# EAGLE design scard (EAGLE 8.4.0)
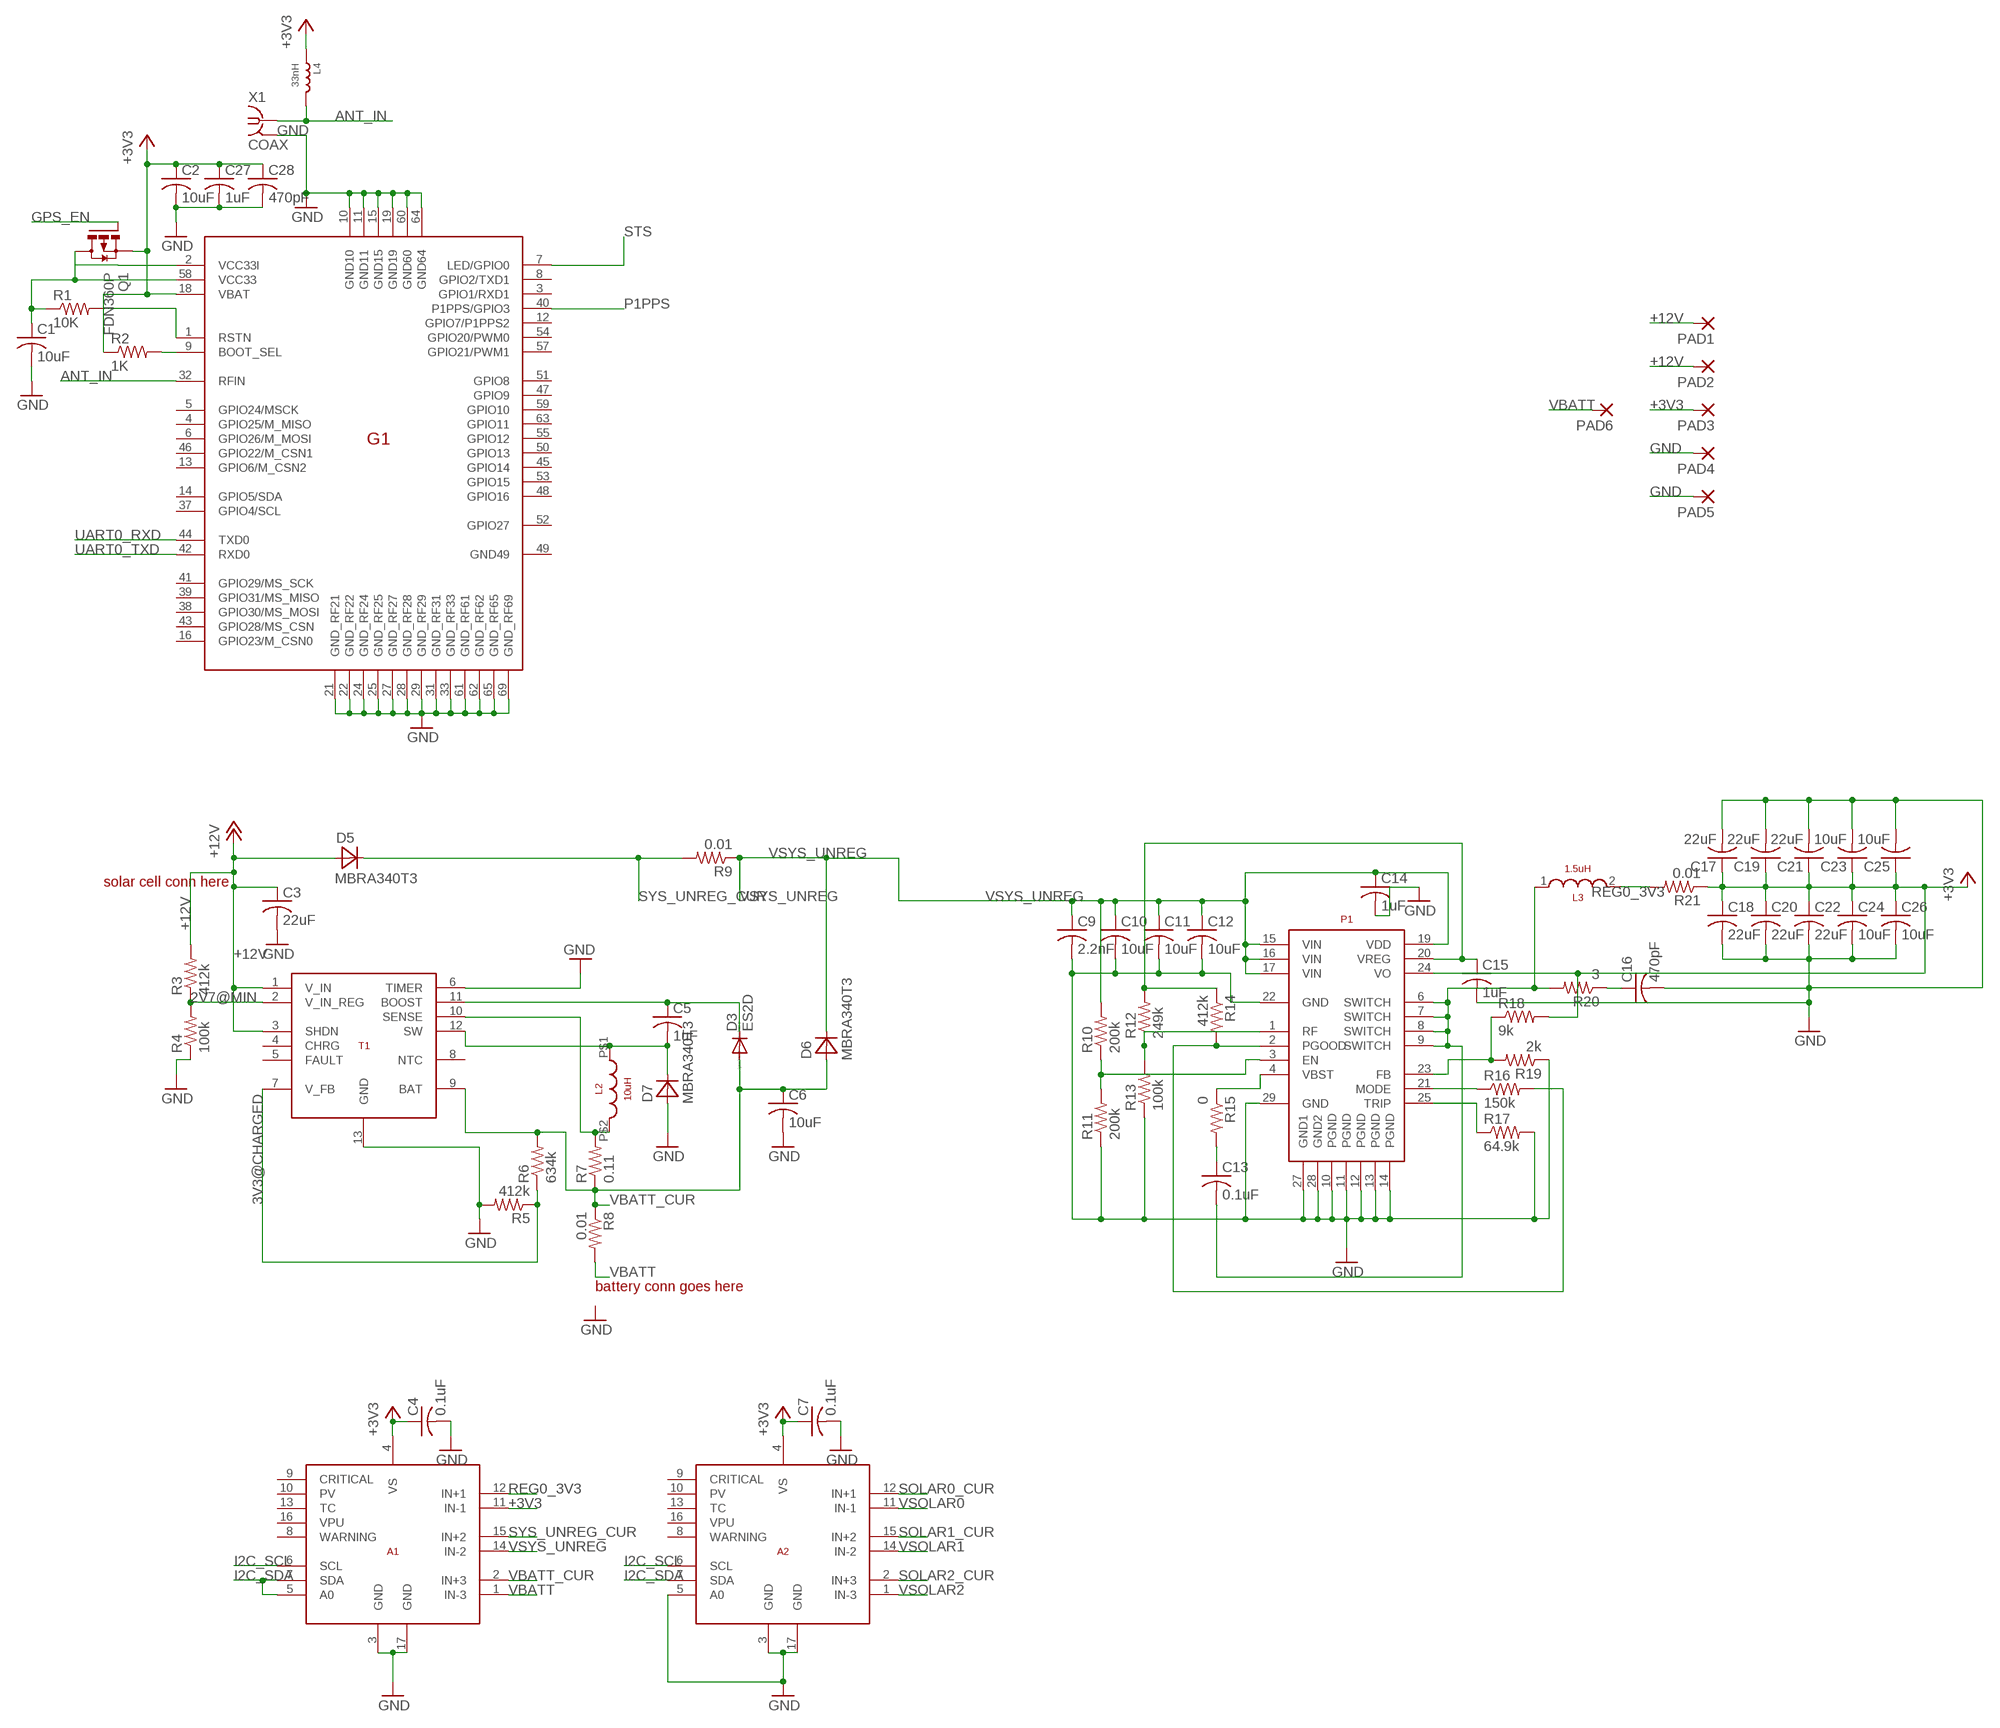
[diagram p0: schematic, sheet 1]

## Parts
A1  INA3221-Q1  [VQFN16]
A2  INA3221-Q1  [VQFN16]
C1  10uF  C-USC0603  [C0603]
C2  10uF  C-USC0603  [C0603]
C3  22uF  C-USC0805  [C0805]
C4  0.1uF  C-USC0603  [C0603]
C5  1uF  C-USC0402  [C0402]
C6  10uF  C-USC0805  [C0805]
C7  0.1uF  C-USC0603  [C0603]
C9  2.2nF  C-USC0402  [C0402]
C10  10uF  C-USC0603  [C0603]
C11  10uF  C-USC0603  [C0603]
C12  10uF  C-USC0603  [C0603]
C13  0.1uF  C-USC0402  [C0402]
C14  1uF  C-USC0402  [C0402]
C15  1uF  C-USC0402  [C0402]
C16  470pF  C-USC0402  [C0402]
C17  22uF  C-USC0805  [C0805]
C18  22uF  C-USC0805  [C0805]
C19  22uF  C-USC0805  [C0805]
C20  22uF  C-USC0805  [C0805]
C21  22uF  C-USC0805  [C0805]
C22  22uF  C-USC0805  [C0805]
C23  10uF  C-USC0603  [C0603]
C24  10uF  C-USC0603  [C0603]
C25  10uF  C-USC0603  [C0603]
C26  10uF  C-USC0603  [C0603]
C27  1uF  C-USC0402  [C0402]
C28  470pF  C-USC0402  [C0402]
D3  ES2D  [SMB]
D5  MBRA340T3  [SMA]
D6  MBRA340T3  [SMA]
D7  MBRA340T3  [SMA]
G1  VENUS838FLPX-L  [LGA69]
L2  10uH  SRP7030-100M  [SRP7030]
L3  1.5uH  SRP7028A  [SRP7028A]
L4  33nH  SMD-FERRITE-BEAD-330R-1500MA(0805)'0805'  [L0805]
P1  TPS548A20  [R-PWQFN-N28]
PAD1  SMD5  [SMD2,54-5,08]
PAD2  SMD5  [SMD2,54-5,08]
PAD3  SMD5  [SMD2,54-5,08]
PAD4  SMD5  [SMD2,54-5,08]
PAD5  SMD5  [SMD2,54-5,08]
PAD6  SMD5  [SMD2,54-5,08]
Q1  FDN360P  [SUPER-SOT3]
R1  10K  R-US_R0603  [R0603]
R2  1K  R-US_R0603  [R0603]
R3  412k  R-US_R0603  [R0603]
R4  100k  R-US_R0603  [R0603]
R5  412k  R-US_R0603  [R0603]
R6  634k  R-US_R0603  [R0603]
R7  0.11  R-US_R0603  [R0603]
R8  0.01  R-US_R0603  [R0603]
R9  0.01  R-US_R0603  [R0603]
R10  200k  R-US_R0603  [R0603]
R11  200k  R-US_R0603  [R0603]
R12  249k  R-US_R0603  [R0603]
R13  100k  R-US_R0603  [R0603]
R14  412k  R-US_R0603  [R0603]
R15  0  R-US_R0603  [R0603]
R16  150k  R-US_R0603  [R0603]
R17  64.9k  R-US_R0603  [R0603]
R18  9k  R-US_R0603  [R0603]
R19  2k  R-US_R0603  [R0603]
R20  3  R-US_R0603  [R0603]
R21  0.01  R-US_R0603  [R0603]
T1  LT3652  [MSOP12]
X1  COAX  [MMCX-J-P-X-ST-EM1-MKT]

## Nets
2V7@MIN: R3.1 R4.2 T1.2(V_IN_REG)
3V3@CHARGED: R5.1 R6.1 T1.7(V_FB)
+3V3: A1.4(VS) A1.11(IN-1) A2.4(VS) C2.1 C4.1 C7.1 C17.1 C18.1 C19.1 C20.1 C21.1 C22.1 C23.1 C24.1 C25.1 C26.1 C27.1 C28.1 G1.18(VBAT) L4.1 P1.24(VO) PAD3.1(P) Q1.2(S) R2.1 R18.2 R21.1
+12V: C3.1 D5.A PAD1.1(P) PAD2.1(P) R3.2 T1.1(V_IN) T1.3(SHDN)
ANT_IN: G1.32(RFIN) L4.2 X1.1
GND: A1.3(GND) A1.17(GND) A2.3(GND) A2.5(A0) A2.17(GND) C1.2 C2.2 C3.2 C4.2 C6.2 C7.2 C9.2 C10.2 C11.2 C12.2 C14.2 C15.2 C16.2 C17.2 C18.2 C19.2 C20.2 C21.2 C22.2 C23.2 C24.2 C25.2 C26.2 C27.2 C28.2 D7.A G1.10(GND10) G1.11(GND11) G1.15(GND15) G1.19(GND19) G1.21(GND_RF21) G1.22(GND_RF22) G1.24(GND_RF24) G1.25(GND_RF25) G1.27(GND_RF27) G1.28(GND_RF28) G1.29(GND_RF29) G1.31(GND_RF31) G1.33(GND_RF33) G1.60(GND60) G1.61(GND_RF61) G1.62(GND_RF62) G1.64(GND64) G1.65(GND_RF65) G1.69(GND_RF69) P1.10(PGND) P1.11(PGND) P1.12(PGND) P1.13(PGND) P1.14(PGND) P1.22(GND) P1.27(GND1) P1.28(GND2) P1.29(GND) PAD4.1(P) PAD5.1(P) R4.1 R5.2 R11.1 R13.1 R17.2 R19.1 T1.6(TIMER) T1.13(GND) X1.2@1(GND)
GPS_EN: Q1.1(G)
I2C_SCL: A1.6(SCL) A2.6(SCL)
I2C_SDA: A1.5(A0) A1.7(SDA) A2.7(SDA)
N$1: P1.21(MODE) R16.1
N$2: C13.2 L3.1 P1.6(SWITCH) P1.7(SWITCH) P1.8(SWITCH) P1.9(SWITCH) R20.2
N$3: C5.1 D3.C T1.11(BOOST)
N$5: P1.4(VBST) R15.1
N$6: L2.P$2 R7.2 T1.10(SENSE)
N$7: G1.9(BOOT_SEL) R2.2
N$8: G1.1(RSTN) R1.2
N$9: C13.1 R15.2
N$10: C15.1 P1.20(VREG) R12.2 R14.1
N$11: P1.1(RF) R12.1 R13.2
N$12: P1.2(PGOOD) R14.2 R16.2
N$13: P1.25(TRIP) R17.1
N$14: P1.23(FB) R18.1 R19.2
N$15: P1.3(EN) R10.1 R11.2
N$16: C1.1 G1.2(VCC33I) G1.58(VCC33) Q1.3(D) R1.1
N$17: C16.1 R20.1
N$18: C5.2 D7.C L2.P$1 T1.12(SW)
P1PPS: G1.40(P1PPS/GPIO3)
REG0_3V3: A1.12(IN+1) L3.2 R21.2
SOLAR0_CUR: A2.12(IN+1)
SOLAR1_CUR: A2.15(IN+2)
SOLAR2_CUR: A2.2(IN+3)
STS: G1.7(LED/GPIO0)
SYS_UNREG_CUR: A1.15(IN+2) D5.C R9.2
UART0_RXD: G1.44(TXD0)
UART0_TXD: G1.42(RXD0)
VBATT: A1.1(IN-3) PAD6.1(P) R8.2
VBATT_CUR: A1.2(IN+3) C6.1 D3.A D6.A R6.2 R7.1 R8.1 T1.9(BAT)
VSOLAR0: A2.11(IN-1)
VSOLAR1: A2.14(IN-2)
VSOLAR2: A2.1(IN-3)
VSYS_UNREG: A1.14(IN-2) C9.1 C10.1 C11.1 C12.1 C14.1 D6.C P1.15(VIN) P1.16(VIN) P1.17(VIN) P1.19(VDD) R9.1 R10.2
Unconnected: A1.8(WARNING) A1.9(CRITICAL) A1.10(PV) A1.13(TC) A1.16(VPU) A2.8(WARNING) A2.9(CRITICAL) A2.10(PV) A2.13(TC) A2.16(VPU) G1.3(GPIO1/RXD1) G1.4(GPIO25/M_MISO) G1.5(GPIO24/MSCK) G1.6(GPIO26/M_MOSI) G1.8(GPIO2/TXD1) G1.12(GPIO7/P1PPS2) G1.13(GPIO6/M_CSN2) G1.14(GPIO5/SDA) G1.16(GPIO23/M_CSN0) G1.37(GPIO4/SCL) G1.38(GPIO30/MS_MOSI) G1.39(GPIO31/MS_MISO) G1.41(GPIO29/MS_SCK) G1.43(GPIO28/MS_CSN) G1.45(GPIO14) G1.46(GPIO22/M_CSN1) G1.47(GPIO9) G1.48(GPIO16) G1.49(GND49) G1.50(GPIO13) G1.51(GPIO8) G1.52(GPIO27) G1.53(GPIO15) G1.54(GPIO20/PWM0) G1.55(GPIO12) G1.57(GPIO21/PWM1) G1.59(GPIO10) G1.63(GPIO11) T1.4(CHRG) T1.5(FAULT) T1.8(NTC)

## Notes on the sheet
- solar cell conn here
- battery conn goes here

## Power pins joined to a net without a drawn wire
GND: X1.2@2(GND) X1.2@3(GND) X1.2@4(GND)

## Library data of the parts
A1 A2 = calsat:INA3221-Q1: INA3221-Q1 current sense amplifier with I2C interface
C1 C5 C17-C22 = rcl:C-US: CAPACITOR, American symbol
C2-C4 C6 C7 C9-C16 C23-C28 = resistor:C-US: CAPACITOR, American symbol
D3 = diode:ES2D: DIODE super fast rectifier, 2 A
D5-D7 = diode:MBRA340T3: Surface Mount Schottky Power Rectifier Source: http://www.onsemi.com/pub_link/Collateral/MBRA340T3-D.PDF
G1 = calsat:VENUS838FLPX-L: aerospace GPS chipset
L2 = calsat:SRP7030-100M: SRP7030-100M 3A 10uH power inductor source: http://www.mouser.com/ds/2/54/SRP7030-33303.pdf
L3 = calsat:SRP7028A: Shielded power inductor
L4 = Seeed-Inductor:SMD-FERRITE-BEAD-330R-1500MA(0805): 303030006; MPN: BLM21PG331SN1D; VALUE: 330R-1500MA
P1 = calsat:TPS548A20: TPS548A20 switching voltage regulator
PAD1-PAD6 = wirepad:SMD5: SMD PAD
Q1 = transistor-power:FDN360P: Single P-Channel, PowerTrench (R) MOSFET Source: http://www.fairchildsemi.com/ds/FD/FDN360P.pdf
R1 R3-R21 = rcl:R-US_: RESISTOR, American symbol
R2 = resistor:R-US_: RESISTOR, American symbol
T1 = calsat:LT3652: LT3652 LiPo Li-ion battery charging IC
X1 = con-samtec:COAX: MMCX STRAIGHT, EDGE MOUNT JACK- 50 OHM Source: http://www.samtec.com/ftppub/cpdf/MMCX-J-P-X-ST-EM1-MKT.pdf; OC_FARNELL: unknown; OC_NEWARK: unknown

## Board
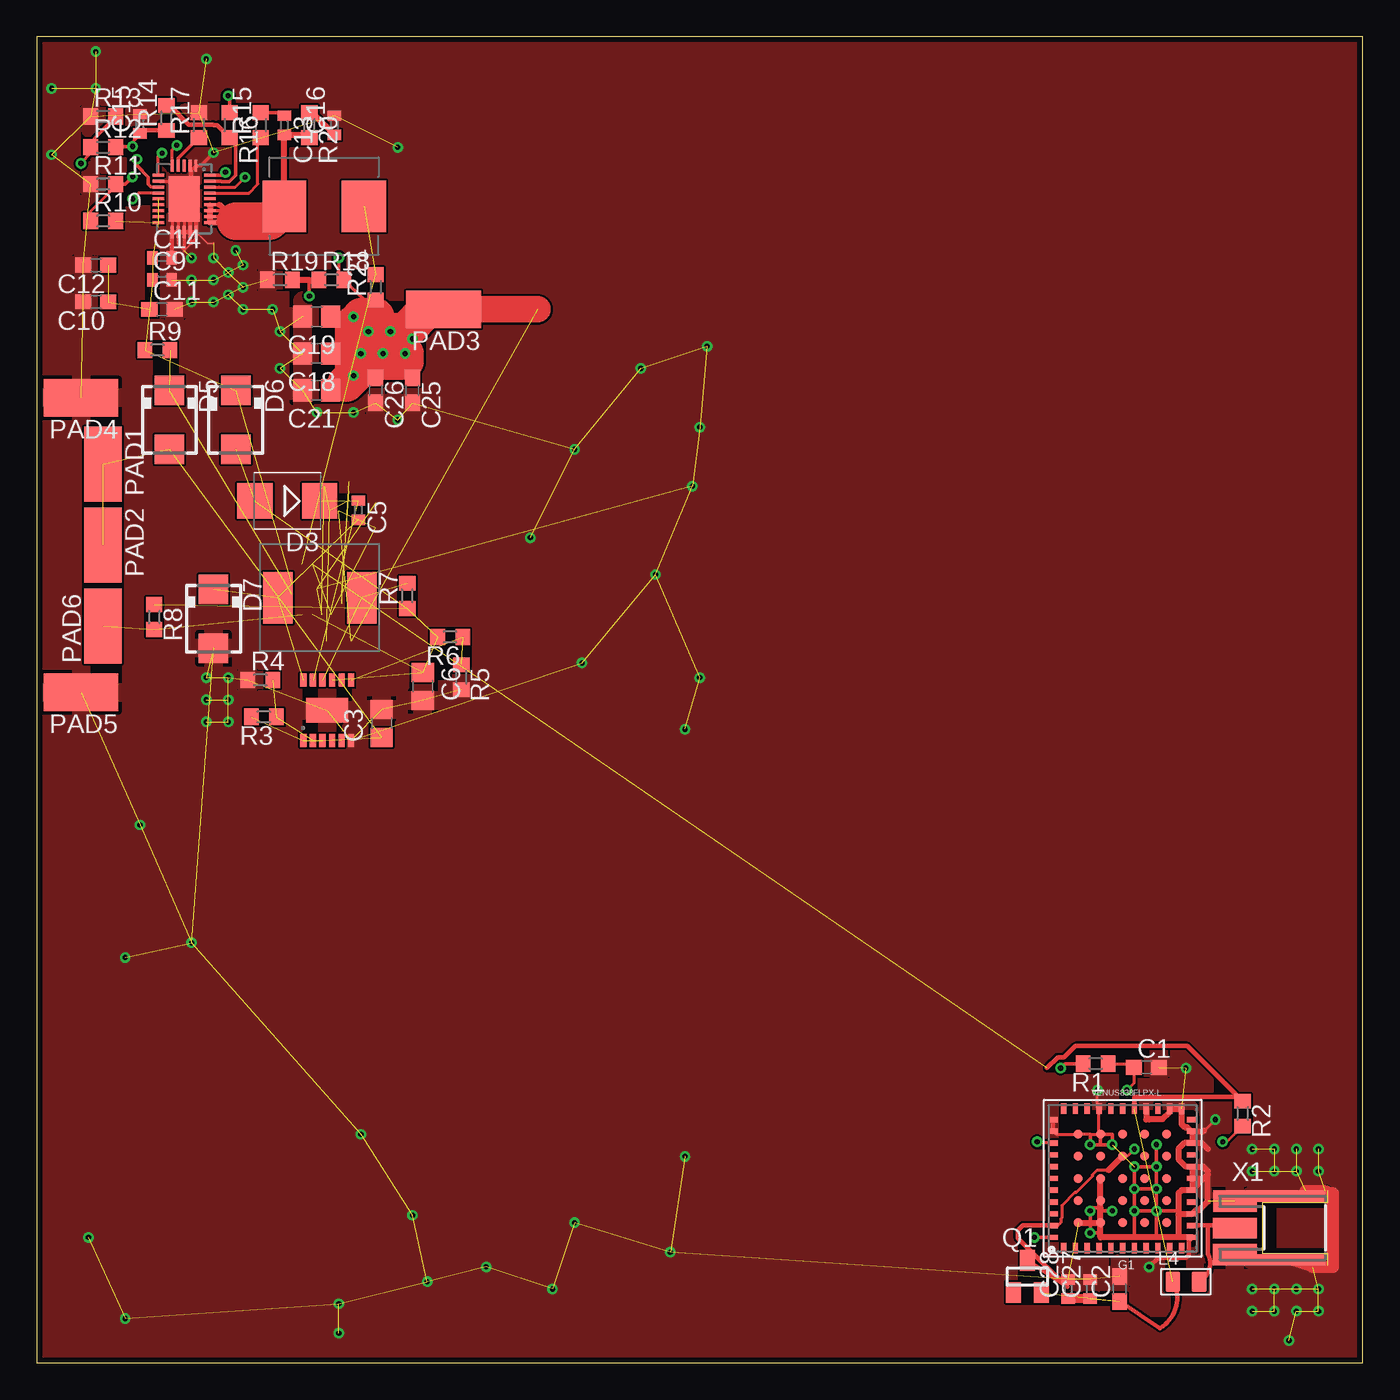
[diagram p1: board, top side]
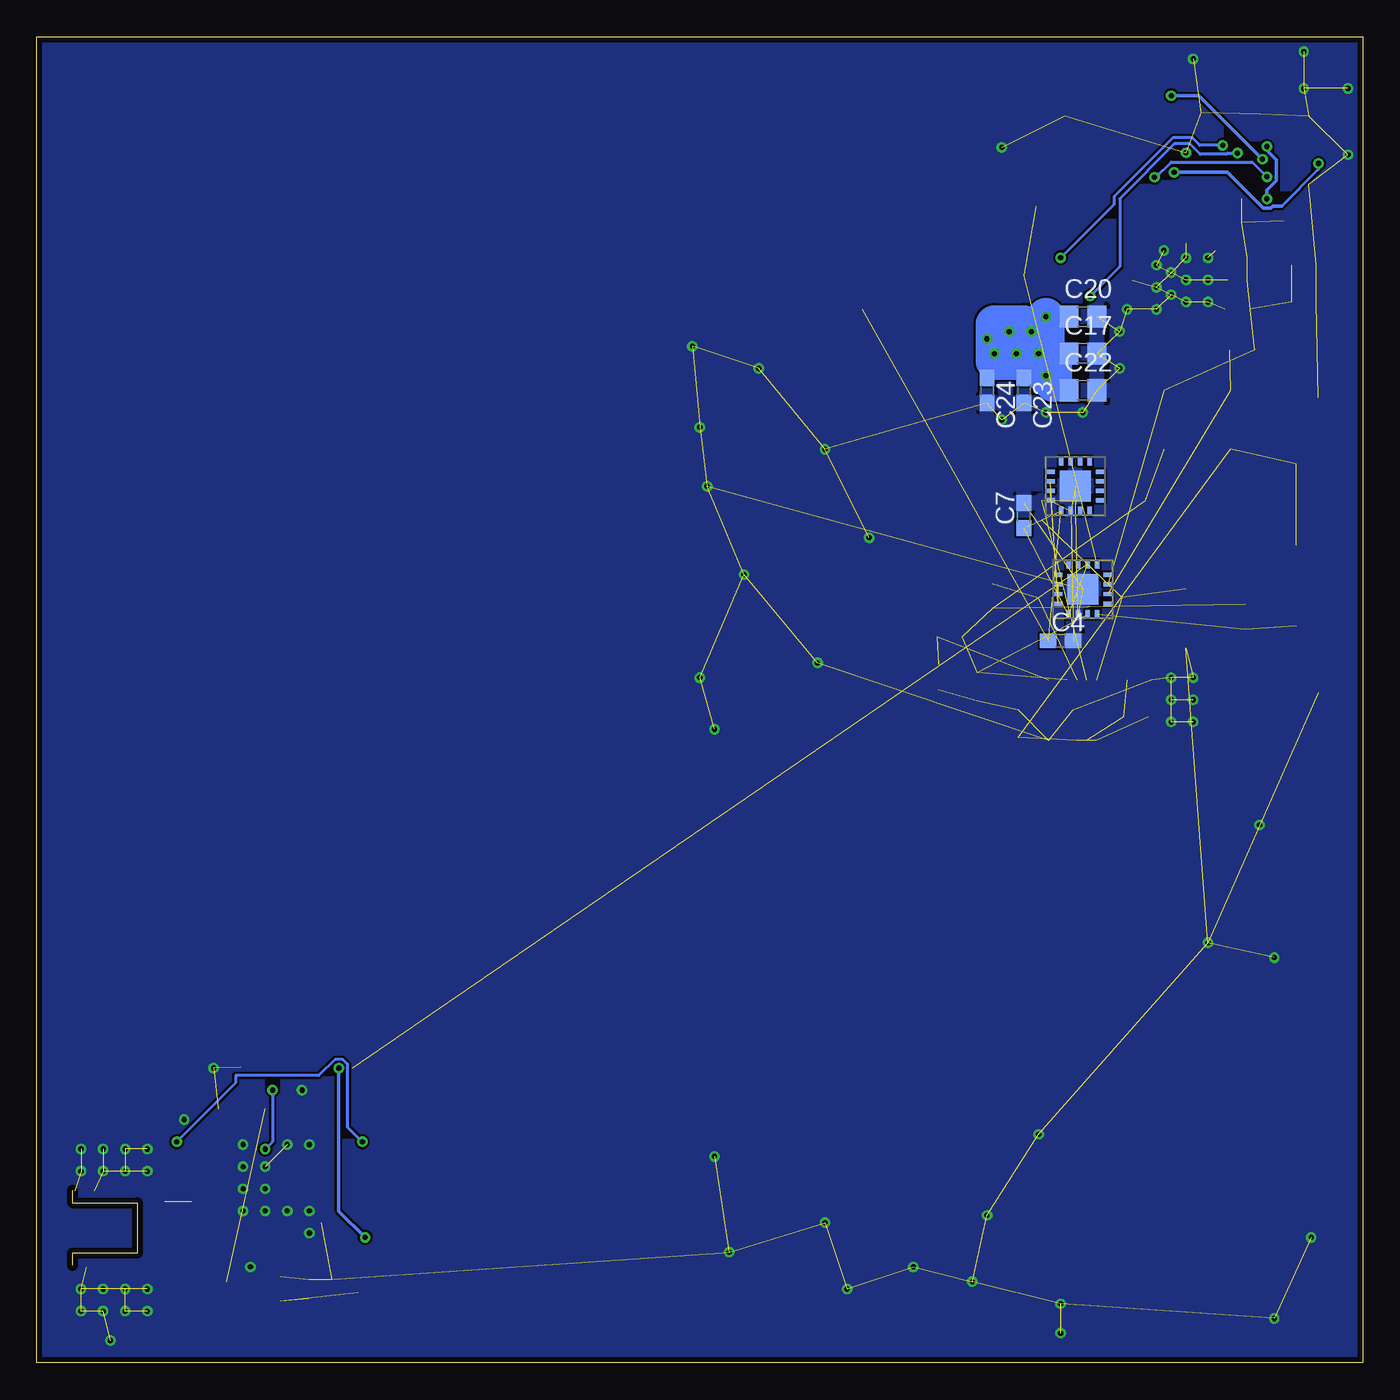
[diagram p2: board, bottom side, seen from below]

Size 90 x 90 mm. Coordinates in mm from the lower left corner, seen from the top.
Outline: 0,0 90,0 90,90 0,90 0,0
Copper layers (1*16): Top 0.0356mm / dielectric 1.5011mm / Bottom 0.0356mm
Design rules "oshpark-2layer": minimum track width 6mil, minimum drill 13mil, track to track 6mil, track to pad 6mil, pad to pad 6mil, via to via 6mil, smd to smd 6mil, copper to edge 15mil, drill to drill 6mil, minimum pad ring 7mil, minimum via ring 7mil, stop-mask expansion 2.5mil, vias tented up to drill 0mil, thermal gap 10mil

### Footprints (pad centres in the part's own frame; a part is rotated, then mirrored left to right if it is on the bottom)
VQFN16 = smd 0.3 x 0.6: 1 -0.975,1.7; 2 -0.325,1.7; 3 0.325,1.7; 4 0.975,1.7; 9 0.975,-1.7; 10 0.325,-1.7; 11 -0.325,-1.7; 12 -0.975,-1.7 | smd 0.6 x 0.3: 5 1.7,0.975; 6 1.7,0.325; 7 1.7,-0.325; 8 1.7,-0.975; 13 -1.7,-0.975; 14 -1.7,-0.325; 15 -1.7,0.325; 16 -1.7,0.975 | smd 2.1 x 2.1: 17 0,0
C0603 = smd 1.1 x 1: 1 -0.85,0; 2 0.85,0
C0805 = smd 1.3 x 1.5: 1 -0.95,0; 2 0.95,0
C0402 = smd 0.7 x 0.9: 1 -0.65,0; 2 0.65,0
SMB = smd 2.4 x 2.4: A 2.2,0; C -2.2,0
SMA = smd 2 x 2: A 2,0; C -2,0
LGA69 = smd 0.7 x 0.36: 1 4.73,4; 2 4.73,3.2; 3 4.73,2.4; 4 4.73,1.6; 5 4.73,0.8; 6 4.73,0; 7 4.73,-0.8; 8 4.73,-1.6; 9 4.73,-2.4; 10 4.73,-3.2; 11 4.73,-4; 23 -4.73,-4; 24 -4.73,-3.2; 25 -4.73,-2.4; 26 -4.73,-1.6; 27 -4.73,-0.8; 28 -4.73,0; 29 -4.73,0.8; 30 -4.73,1.6; 31 -4.73,2.4; 32 -4.73,3.2; 33 -4.73,4 | smd 0.36 x 0.7: 12 4,-4.73; 13 3.2,-4.73; 14 2.4,-4.73; 15 1.6,-4.73; 16 0.8,-4.73; 17 0,-4.73; 18 -0.8,-4.73; 19 -1.6,-4.73; 20 -2.4,-4.73; 21 -3.2,-4.73; 22 -4,-4.73; 34 -4,4.73; 35 -3.2,4.73; 36 -2.4,4.73; 37 -1.6,4.73; 38 -0.8,4.73; 39 0,4.73; 40 0.8,4.73; 41 1.6,4.73; 42 2.4,4.73; 43 3.2,4.73; 44 4,4.73 | smd 0.6 x 0.6: 45 -3,3; 46 -3,1.5; 47 -3,0; 48 -3,-1.5; 49 -3,-3; 50 -1.5,3; 51 -1.5,1.5; 52 -1.5,0; 53 -1.5,-1.5; 54 -1.5,-3; 55 0,3; 56 0,1.5; 57 0,0; 58 0,-1.5; 59 0,-3; 60 1.5,3; 61 1.5,1.5; 62 1.5,0; 63 1.5,-1.5; 64 1.5,-3; 65 3,3; 66 3,1.5; 67 3,0; 68 3,-1.5; 69 3,-3
SRP7030 = smd 2 x 3.5: P$1 -2.85,0; P$2 2.85,0
SRP7028A = smd 2.95 x 3.5: 1 -2.7,0 | smd 3 x 3.5: 2 2.7,0
L0805 = smd 1.016 x 1.397: 1 -0.889,0; 2 0.889,0
R-PWQFN-N28 = smd 0.2 x 0.8: 1 -1.6,1.75; 2 -1.2,1.75; 3 -0.8,1.75; 4 -0.4,1.75; 5 0,1.75; 6 0.4,1.75; 7 0.8,1.75; 8 1.2,1.75; 9 1.6,1.75; 15 1.6,-1.75; 16 1.2,-1.75; 17 0.8,-1.75; 18 0.4,-1.75; 19 0,-1.75; 20 -0.4,-1.75; 21 -0.8,-1.75; 22 -1.2,-1.75; 23 -1.6,-1.75 | smd 0.8 x 0.2: 10 2.25,0.8; 11 2.25,0.4; 12 2.25,0; 13 2.25,-0.4; 14 2.25,-0.8; 24 -2.25,-0.8; 25 -2.25,-0.4; 26 -2.25,0; 27 -2.25,0.4; 28 -2.25,0.8 | smd 3.1 x 2.1: 29 0,0
SMD2,54-5,08 = smd 2.54 x 5.08: 1 0,0
SUPER-SOT3 = smd 1 x 1.4: 1 -0.95,-1.1; 2 0.95,-1.1; 3 0,1.1
R0603 = smd 1 x 1.1: 1 -0.85,0; 2 0.85,0
MSOP12 = smd 0.42 x 0.889: 1 -1.63,-2.04; 2 -0.98,-2.04; 3 -0.33,-2.04; 4 0.32,-2.04; 5 0.97,-2.04; 6 1.62,-2.04; 7 1.62,2.05; 8 0.97,2.05; 9 0.32,2.05; 10 -0.33,2.05; 11 -0.98,2.05; 12 -1.63,2.05 | smd 2.845 x 1.651: 13 0,0
MMCX-J-P-X-ST-EM1-MKT = smd 1.4 x 2.975: 1 0,-6.15 | smd 1.46 x 2.975: 2@1 -1.812,-6.125; 2@2 1.812,-6.138 | smd 0.76 x 4.7: 2@3 -2.163,-2.35; 2@4 2.163,-2.35

### Placement (x,y rotation side)
A1  19,52.5 180 bottom
A2  19.5,59.5 180 bottom
C1  75.32,20.05 0 top
C2  73.5,5 90 top
C3  23.41,43.39 90 top
C4  20.5,49 0 bottom
C5  21.82,57.87 270 top
C6  26.2,45.91 270 top
C7  23,57.5 90 bottom
C9  8.5,73.5 0 top
C10  4,72 180 top
C11  8.5,71.5 0 top
C12  4,74.5 180 top
C13  16.8,84 270 top
C14  8.5,75 0 top
C15  7,84.1 90 top
C16  20.2,84 90 top
C17  19,68.5 0 bottom
C18  19,68.5 180 top
C19  19,71 180 top
C20  19,71 0 bottom
C21  19,66 180 top
C22  19,66 0 bottom
C23  23,66 270 bottom
C24  25.5,66 270 bottom
C25  25.5,66 270 top
C26  23,66 270 top
C27  71.5,5 90 top
C28  70,5 90 top
D3  17,58.5 180 top
D5  9,64 270 top
D6  13.5,64 270 top
D7  12,50.5 270 top
G1  73.7,12.51 180 top
L2  19.2,51.93 0 top
L3  19.5,78.5 0 top
L4  78,5.5 0 top
P1  10,79 270 top
PAD1  4.5,61 180 top
PAD2  4.5,55.5 180 top
PAD3  27.6,71.5 90 top
PAD4  3,65.5 90 top
PAD5  3,45.5 90 top
PAD6  4.5,50 0 top
Q1  67.24,5.85 0 top
R1  71.87,20.3 180 top
R2  81.85,16.91 270 top
R3  15.41,43.84 180 top
R4  15.17,46.35 0 top
R5  28.81,46.53 270 top
R6  28.06,49.26 180 top
R7  25.15,52.05 90 top
R8  7.97,50.62 270 top
R9  8.19,68.74 0 top
R10  4.5,77.5 0 top
R11  4.5,80 0 top
R12  4.5,82.5 0 top
R13  4.5,84.6 0 top
R14  8.8,84.5 90 top
R15  15.2,84 90 top
R16  13.1,84 270 top
R17  11,84 90 top
R18  20,73.5 0 top
R19  16.5,73.5 0 top
R20  18.5,84 270 top
R21  23,73 90 top
T1  19.72,44.28 0 top
X1  87.46,9.15 270 top

### Tracks (layer width: path | path; a pad name or v marks a point on that pad's centre or on a via)
2V7@MIN  (2 unrouted)
3V3@CHARGED  (2 unrouted)
+3V3  (via drill 0.35)  (9 unrouted)
  Top 0.203: P1.24 9.2,82.33 v9.5,82.63 | v20.5,75 20.5,73.85 R18.2 | v21.5,67 20.95,67 C22.1 | C17.1 21.5,68.5 21.5,68 | 23,68 C26.1 | 25,68 25,67.35 C25.1 | 22,71 C19.1 | PAD3.1 26.5,71.5
  Top 0.254: R18.2 22.2,72.15 R21.1 23,71
  Top 0.305: G1.18 74.5,18 74.56,18.05 81.56,18.05 | R2.1 81.56,18.05 | 81.56,18.05 78.11,21.5 70.5,21.5 69.73,20.73 69.3,20.73 68.57,20 | L4.1 arc-90 76.24,2.35 C2.1 | 26,71.5 26.5,71.5 | v22,68.5 21.5,68.5 | v23.5,68.5 23.5,68 23,68 | v25.5,69.5 25,70 | v24,70 23.5,70 | 22,71 22,70.5 21.5,70.5 v21.5,71 23,71
  Top 0.61: 34,71.5 34.5,71.5 | C27.1 C28.1
  Top 1.8: PAD3.1 34,71.5
  Top 2.54: 23,71 22,71 | 21.5,68.5 21.5,70.5 | 21,66.5 v21.5,67 21.5,68 23,68 25,68 v25,68.5 23.5,70 25,70 26.5,71.5
  Bottom 0.203: v9.5,82.63 11.07,82.63 11.58,83.14 12.89,83.14 16.88,79.16 16.88,78.62 v20.5,75 | 25,68 25.5,67.5 C25.1 | 23,68 C26.1 | v21.5,67 20.5,66 C22.1 | 21.5,68.5 C17.1
  Bottom 0.305: C19.1 v21.5,71 21.5,70
  Bottom 2.54: v21.5,71 21.5,68.5 v21.5,67 21,66.5 21,68 23,68 25,68 25,70.5 23,70.5 | v22.5,70 21.5,70
+12V  (6 unrouted)
ANT_IN
  Top 0.254: 81.5,9.31 81.5,9 82.31,9 X1.1
  Top 0.305: 79.5,9.31 G1.32 | 79.5,9.31 80.65,9.31 X1.1 | L4.2 arc90 79.5,7.39 79.5,9.31
GND  (via drill 0.35)  (116 unrouted)
  Top 0.152: G1.29 G1.28 G1.27 | P1.10 11.55,76 12,76 | P1.11 10.4,76.6 | 9.6,76 9.6,75.9 10,75.5 10.4,75.9 | 10.4,76 10.4,75.9 | 10.5,76 10.4,75.9
  Top 0.2: G1.69 71.5,15.51 G1.64 72.1,15.61 G1.15 72,17.34 v72,18.5 | G1.62 G1.61 72.2,10.5 | G1.25 78.43,15 78.43,15.62 G1.24 | 79.25,15.75 v80,16.5 | 77.5,8.5 77.5,8.51 77.5,10 77.5,10.5 | 72.2,8.5 72.5,8.5 72.5,8.51 74.5,8.51 | 75.3,16.5 75.5,16.5 | 76.9,17 G1.21 | 78,13.31 G1.27
  Top 0.203: G1.10 69.17,15.51 G1.69 | P1.22 9.3,80.2 | 10,77.5 P1.12 | P1.13 9.6,77.4 9.5,77.5 | P1.14 9.2,78.2 9.5,78.5
  Top 0.254: P1.27 10.4,80.1 10.5,80 10.5,80.95 P1.28 11.12,81.25 v12,82.13 | 9.5,80 9.3,80.2 | P1.12 10,75.5 | P1.13 9.6,76 | P1.11 10.4,76 | P1.10 10.8,76.3 10.5,76 | v73,10.3 72.4,10.3 arc-90 72.2,10.5 71.5,10.5 v71.5,10.3 71.5,9.51 v71.5,8.8 72.2,8.8 72.2,8.51 | v74.5,10.3 74.5,8.51 | v74.5,11.8 v74.5,10.3 | v74.5,11.8 v74.5,13.3 v76,13.3 | v76,14.8 v76,13.3 | v76,13.3 v76,11.8 | v76,11.8 v74.5,11.8 | v76,11.8 v76,10.3 | v76,10.3 v74.5,10.3 | v76,10.3 76,8.51 | v76,10.3 77.5,10.3 77.5,10.5 | 72.2,14.8 G1.64 72.99,15.51 73,15.5 v73,14.8 72.2,14.8 | 72.2,14.8 v71.5,14.8 71.5,15.51
  Top 0.305: G1.11 G1.10 | X1.2@1 82.77,11.4 86.11,11.4 | X1.2@2 82.76,6.9 86.11,6.9 | v75.5,6.5 76.12,7.12 78.01,7.12 78.19,7.3 78.19,8.27 G1.33 | P1.29 10,80 9.5,80 | P1.29 10,80.1 10.4,80.1 | P1.29 10,78.5 9.5,78.5 | C14.2 9.15,76.75 P1.14 P1.13 P1.12 P1.11 | P1.11 P1.10 10.8,78 10.4,78 P1.11
  Top 0.406: 86.11,11.65 86.11,11.4 X1.2@3 | X1.2@4 86.11,6.9 | G1.33 77.5,8.51 | 77.5,8.51 76,8.51 74.5,8.51 72.2,8.51 | 72.2,8.5 G1.60 | G1.60 72.2,10.5 G1.62 | G1.65 71.5,9.51 G1.60 | G1.19 75.3,16.5 | 75.5,16.5 75.53,16.53 76.43,16.53 76.89,17 76.9,17 | G1.21 G1.22 77.7,16.21 77.93,15.97 78.08,15.97 78.43,15.62 | 78.43,15 G1.24 79.21,15.71 79.25,15.75 | 79.5,14.5 79.09,14.91 G1.25 77.91,14.91 77.5,14.5 77.5,13.81 78,13.31 | G1.29 G1.27 79.19,13.31 79.5,13 79.5,12.78 | 79.23,12.51 G1.29 | G1.28 79.23,12.51 | 79.23,12.51 79.5,12.78 | G1.29 77.71,11.71 77.5,11.5 77.5,10.5 77.5,8.51 | 77.5,10 arc-90 77.61,10.11 G1.31 78.69,10.37 78.93,10.37 79.5,10.95 79.5,12.78
  Top 0.813: X1.2@4 86.6,6.5 88,6.5 88,11.5 87.99,11.49 87.76,11.49 87.42,11.65 86.11,11.65
  other vias: 1,86.5 33.5,56 16,71.5 42,53.5 85,1.5 45.5,69 20.5,2 30.5,6.5 3.5,8.5 10.5,28.5 20.5,4 22,15.5 44,43 37,47.5 13,46.5 1,82 4,89 24.5,82.5 21.5,64.5 41,67.5 44.5,59.5 16.5,67.5 45,63.5 16.5,70 6,3 6,27.5 7,36.5 78,20 19,64.5 24.5,64 85.5,5 84,5 82.5,5 85.5,3.5 84,3.5 82.5,3.5 85.5,13 84,13 82.5,13 82.5,14.5 84,14.5 85.5,14.5 87,14.5 87,13 87,5 87,3.5 11.5,46.5 13,43.5 11.5,43.5 36.5,9.5 25.5,10 26.5,5.5 35,5 36.5,62 4,86.5 11.5,88.5 12,75 13.5,75.5 10.5,75 12,73.5 10.5,73.5 13,74 14,73 14,74.5 10.5,72 14,71.5 12,72 13,72.5 45,46.5 11.5,45 13,45 44,14 43,7.5
  pour Top: -3,92.5 -3,-7 94,-7 94,92.5
  pour Bottom: -4.5,94 -5,-9.5 97,-9.5 97.5,94
I2C_SCL  (1 unrouted)
I2C_SDA  (2 unrouted)
N$1  (via drill 0.35)
  Top 0.203: 7.73,79.82 8.23,79.82 P1.21
  Top 0.254: R16.1 13.1,85.9 v13,86 | v6.8,81.7 6.8,81.25 7.57,80.48 7.57,79.98 7.73,79.82
  Bottom 0.254: v13,86 11.11,86 v6.8,81.7
N$2
  Top 0.254: 11.75,78.5 P1.6 12.4,78.6 | P1.7 12.8,78.2 13,78 12.8,77.8 P1.8
  Top 0.406: 11.75,78.54 11.75,78.5 P1.7 P1.8 P1.9 13.4,77.4 13.5,77.5 13,78 12.4,78.6 | L3.1 C13.2 18.5,83.35 R20.2
  Top 2.54: L3.1 15.8,77.5 13.5,77.5
N$3  (2 unrouted)
N$5
  Top 0.203: P1.4 14.4,79.4 15,80 15,82.95 R15.1
N$6  (2 unrouted)
N$7  (via drill 0.35)
  Top 0.2: G1.9 68,14.91 v67.91,15 | v80.5,15 80.79,15 R2.2
  Bottom 0.2: v67.91,15 68.89,15.99 68.89,20.25 69.25,20.61 69.75,20.61 70.86,19.5 76.5,19.5 76.5,19 v80.5,15
N$8  (via drill 0.35)
  Top 0.254: G1.1 v67.72,8.5 | v69.5,20 69.8,20.3 R1.2
  Bottom 0.254: v67.72,8.5 69.5,10.28 v69.5,20
N$9
  Top 0.254: R15.2 16.8,84.85 C13.1
N$10  (via drill 0.35)
  Top 0.203: P1.20 6.9,79.4
  Top 0.254: 6.9,79.4 v6.5,79 | R12.2 5.41,82.56 v6.5,82.56 6.5,82.85 C15.1 | R14.1 8.6,83.35
  Top 0.305: C15.1 7,83.65 R14.1
  Bottom 0.254: v6.5,82.56 6.5,82.29 5.87,81.66 5.87,80.24 6.5,79.61 v6.5,79
N$11  (via drill 0.35)
  Top 0.203: R12.1 3.65,82.15 v3,81.4
  Top 0.254: R12.1 3.65,82.8 R13.2 | P1.1 12.6,80.6 v12.8,80.8
  Bottom 0.203: v3,81.4 3,81 5.5,78.5
  Bottom 0.254: 5.5,78.5 6.11,78.5 6.24,78.37 6.76,78.37 9.2,80.8 v12.8,80.8
N$12
  Top 0.203: 12,80.19 11.99,80.2 P1.2
  Top 0.254: 13,83.05 R16.2 13.5,82.75 13.5,80.61 13.06,80.17 12.54,80.17 12.52,80.19 12,80.19 P1.2
  Top 0.305: R14.2 9.02,85.35 10.32,84.05 11.96,84.05 12,84 12.25,84 R16.2
N$13
  Top 0.254: P1.25 9.6,81.75 R17.1
N$14  (via drill 0.35)
  Top 0.203: P1.23 8.25,81.9 8.29,81.9 v8.5,82.11
  Top 0.254: v18.5,72.4 18.5,73.5
  Top 0.406: R18.1 18.5,73.5 R19.2
  Bottom 0.203: v8.5,82.11 9.17,82.11 9.25,82.03 11.04,82.03 11.75,82.74 12.71,82.74 12.74,82.76 16.5,79 16.5,74.4 v18.5,72.4
N$15  (via drill 0.35)
  Top 0.203: P1.3 12.37,79.8 12.38,79.79 13.45,79.79 v14.13,80.47 | R10.1 3.65,78.15 5.5,80
  Top 0.254: v6.5,80.5 6,80 5.5,80 R11.2
  Bottom 0.203: v6.5,80.5 7.5,81.5 13,81.5 14.03,80.47 v14.13,80.47
N$16  (via drill 0.35)
  Top 0.2: R1.1 74.22,20.3 C1.1 74.47,18.97 v74,18.5 | v74.5,14.5 74.01,14.01 G1.58 | 72.75,13.06 71.97,13.06 71.65,12.74 71.65,12.65 70.56,11.56 70.47,11.56 69.57,10.66 69.57,9.82 69.5,9.75 69.5,9.5 69.31,9.31
  Top 0.203: G1.2 69.31,9.31
  Top 0.305: Q1.3 69.95,5.14 68.58,6.51 68.52,6.51 66.61,8.43 66.61,9 66.92,9.31 G1.2
  Top 0.406: 72.75,13.06 G1.58
  Bottom 0.2: v74,18.5 74,15 v74.5,14.5
N$17
  Top 0.406: R20.1 18.7,84.85 19.6,83.94 19.61,83.94 C16.1
N$18  (3 unrouted)
NONE
  cutout Top: 84,11 84,7.5 79,7.5 79,11
  cutout Top: 78.5,17 78.5,8 69.5,8 69.5,17
REG0_3V3  (2 unrouted)
SYS_UNREG_CUR  (2 unrouted)
VBATT  (2 unrouted)
VBATT_CUR  (7 unrouted)
VSYS_UNREG  (12 unrouted)